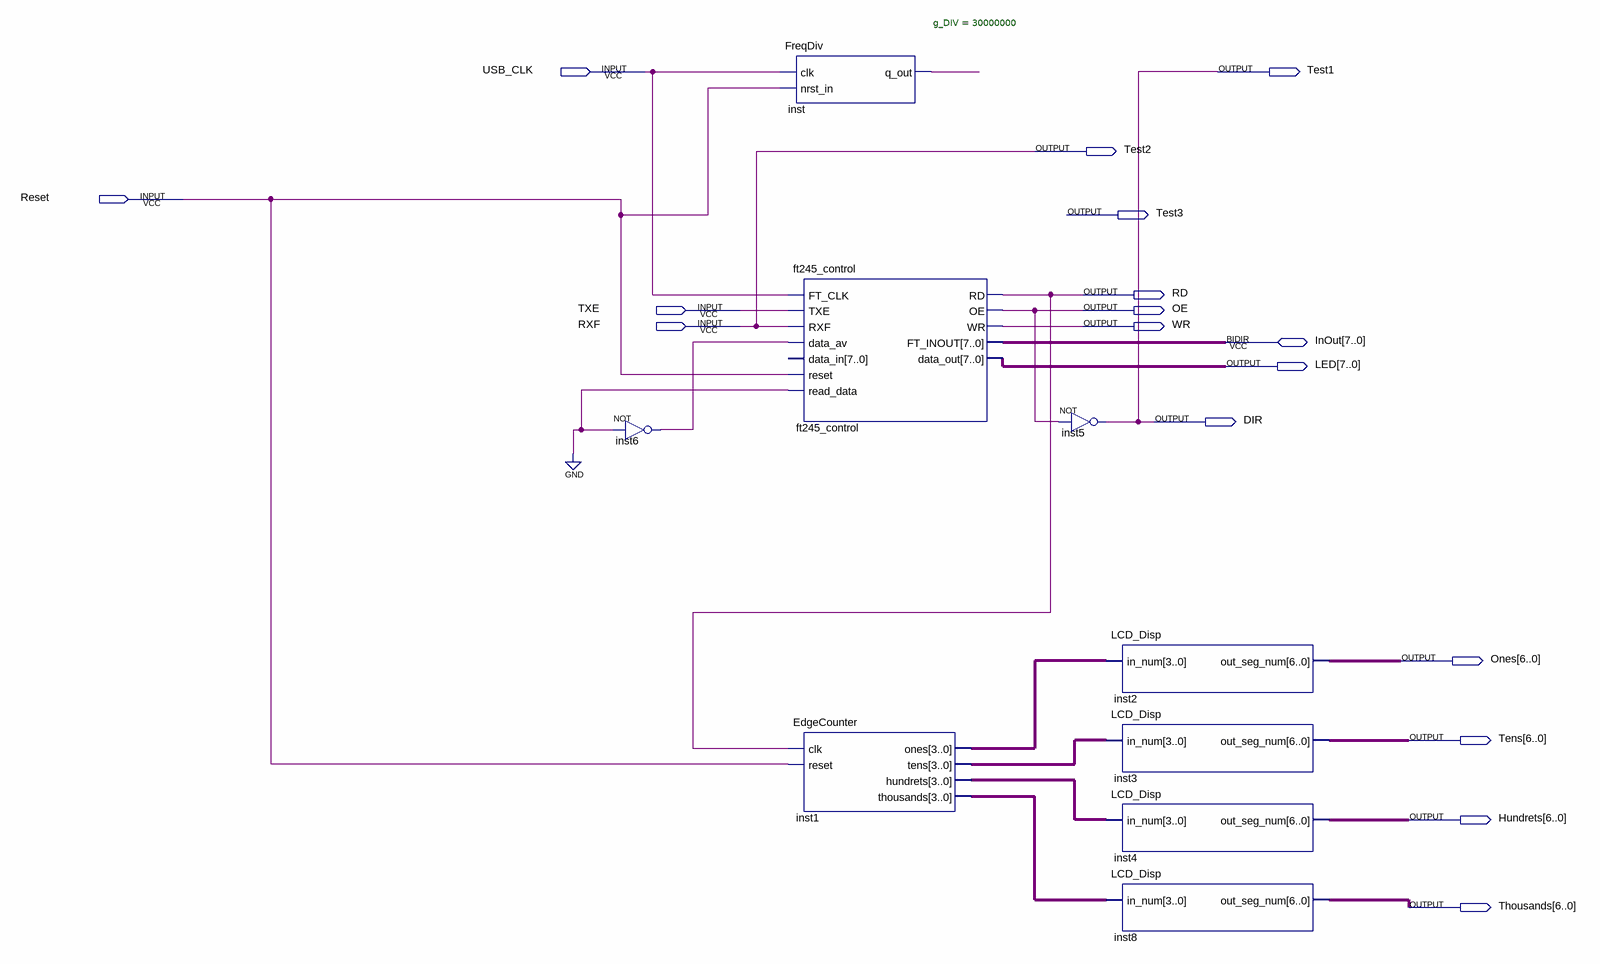
[diagram p0: schematic sheet]
// Quartus schematic FT245_Interface.bdf as structural Verilog: 9 symbols, 17 pins
module FT245_Interface (
  input  USB_CLK,
  input  Reset,
  input  TXE,
  input  RXF,
  inout  [7:0] InOut,
  output Test1,
  output Test2,
  output Test3,
  output RD,
  output OE,
  output WR,
  output [7:0] LED,
  output DIR,
  output [6:0] Ones,
  output [6:0] Tens,
  output [6:0] Hundrets,
  output [6:0] Thousands
);

  wire inst6_out, inst_q_out;
  wire [3:0] inst1_hundrets, inst1_ones, inst1_tens, inst1_thousands;

  not inst6 (inst6_out, 1'b0);
  FreqDiv #(.g_DIV(30000000)) inst (.clk(USB_CLK), .nrst_in(Reset), .q_out(inst_q_out));
  ft245_control ft245_control (
    .FT_CLK(USB_CLK), .TXE(TXE), .RXF(RXF), .data_av(inst6_out), .reset(Reset), .read_data(1'b0), .RD(RD),
    .OE(OE), .WR(WR), .data_out(LED), .FT_INOUT(InOut));  // open: data_in
  EdgeCounter inst1 (
    .clk(RD), .reset(Reset), .ones(inst1_ones), .tens(inst1_tens), .hundrets(inst1_hundrets),
    .thousands(inst1_thousands));
  not inst5 (DIR, OE);
  LCD_Disp inst2 (.in_num(inst1_ones), .out_seg_num(Ones));
  LCD_Disp inst3 (.in_num(inst1_tens), .out_seg_num(Tens));
  LCD_Disp inst4 (.in_num(inst1_hundrets), .out_seg_num(Hundrets));
  LCD_Disp inst8 (.in_num(inst1_thousands), .out_seg_num(Thousands));

  assign Test1 = DIR;
  assign Test2 = RXF;
endmodule
